# Altium project TM7705.PrjPcb
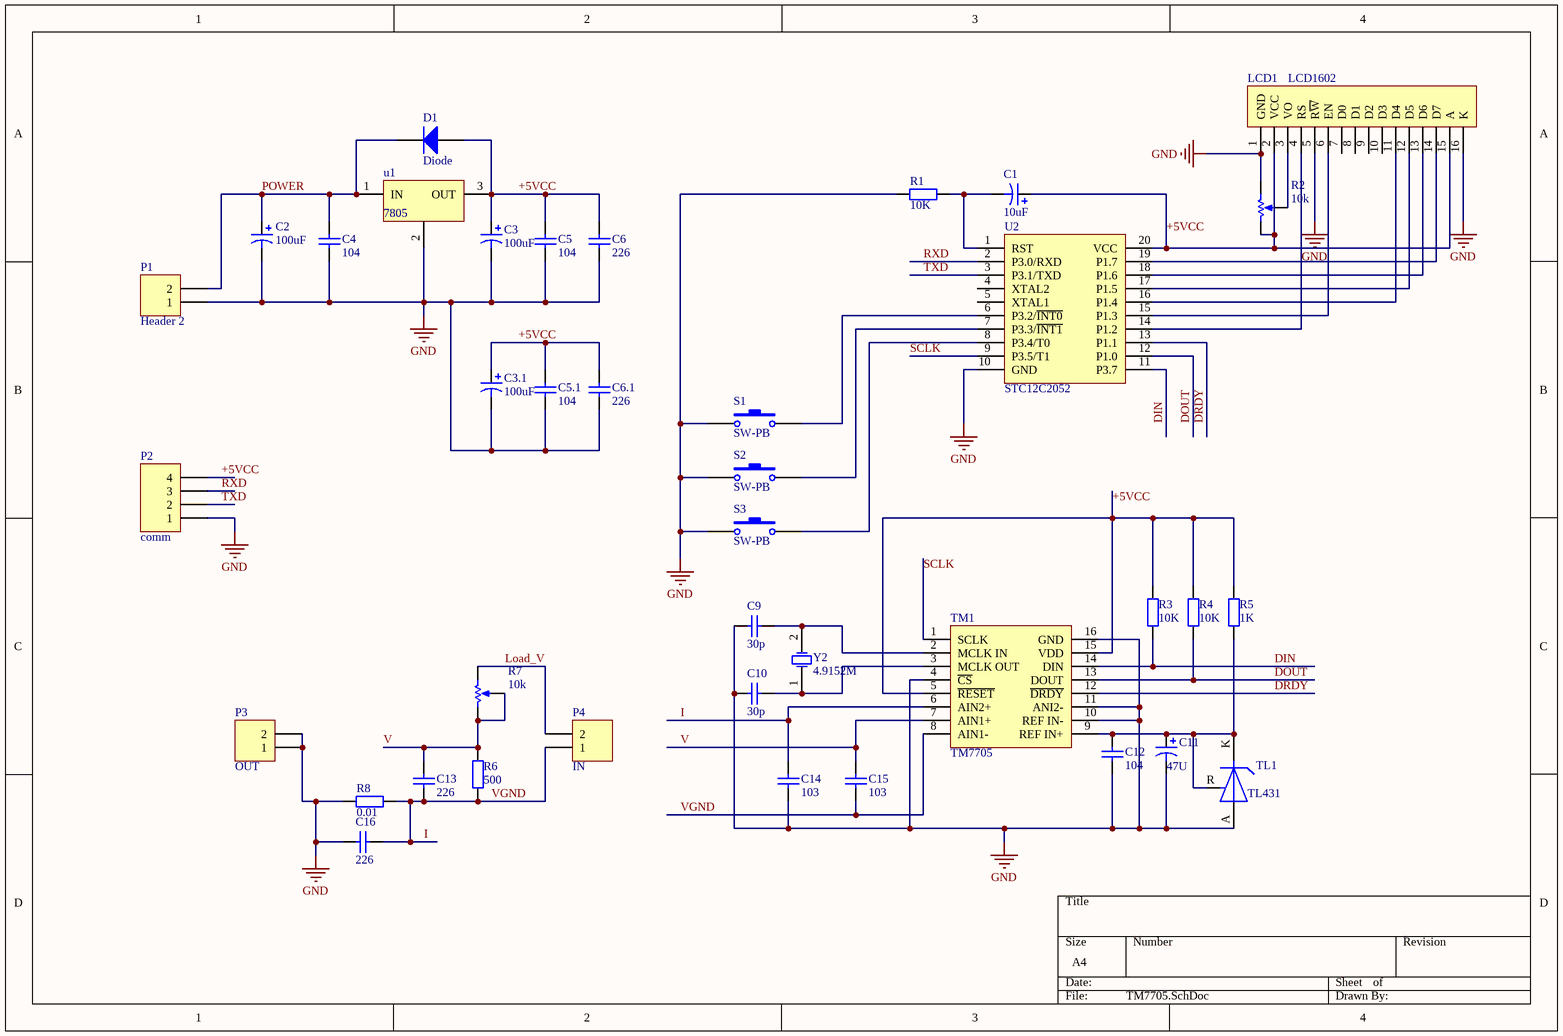
[diagram p0: TM7705.SchDoc]
1 sheet, 39 parts. Net scope: global (net labels, ports and power ports of the same name join across sheets).
Board files: TM7705dayin.PcbDoc, TM7705.PcbDoc

## Sheet TM7705.SchDoc
size A4

### Parts
C1  10uF  [0805]
C2  100uF  [DR3]
C3  100uF  [DR]
C3.1  100uF  [DR]
C4  104  [0805C]
C5  104  [0805C]
C5.1  104  [0805C]
C6  226  [0805C]
C6.1  226  [0805C]
C9  30p  [0805C]
C10  30p  [0805C]
C11  47U  [DR]
C12  104  [0805C]
C13  226  [0805C]
C14  103  [0805C]
C15  103  [0805C]
C16  226  [0805C]
D1  Diode  [DO-214AC]
LCD1  LCD1602  [LCD1602]
P1  Header 2  [HDR1X2]
P2  comm  [HDR1X4]
P3  OUT  [HDR1X2]
P4  IN  [HDR1X2]
R1  10K  [0805R]
R2  10k  [DWQ]
R3  10K  [0805R]
R4  10K  [0805R]
R5  1K  [0805R]
R6  500  [0805R]
R7  10k  [DWQ1]
R8  0.01  [DZ-1W]
S1  SW-PB  [SW]
S2  SW-PB  [SW]
S3  SW-PB  [SW]
TL1  TL431  [TL431]
TM1  TM7705  [SOIC-16]
u1  7805  [DPAK]
U2  STC12C2052  [SOIC-20]
Y2  4.9152M  [JZ]

### Nets
GND: C2.2 C3.2 C3.1.2 C4.1 C5.1 C5.1.1 C6.1 C6.1.1 C9.1 C10.1 C11.2 C12.1 C14.1 C16.2 LCD1.1(GND) LCD1.5(R~{W}) LCD1.16(K) P1.1 P2.1 P3.1 P3.2 R1.2 R2.1(TOP) R8.2 S1.1 S2.1 S3.1 TL1.A TM1.4(~{CS}) TM1.10(REF_IN-) TM1.11(ANI2-) TM1.16(GND) u1.2(GND) U2.10(GND)
+5VCC: C1.1 C3.1 C3.1.1 C5.2 C5.1.2 C6.2 C6.1.2 D1.1(A) LCD1.2(VCC) LCD1.15(A) P2.4 R2.2(BOT) R3.2 R4.2 R5.2 TM1.5(~{RESET}) TM1.15(VDD) u1.3(OUT) U2.20(VCC)
DIN: R3.1 TM1.14(DIN) U2.11(P3.7)
DOUT: R4.1 TM1.13(DOUT) U2.12(P1.0)
DRDY: TM1.12(~{DRDY}) U2.13(P1.1)
I: C13.1 C14.2 C15.1 C16.1 P4.1 R6.1 R8.1 TM1.6(AIN2+) TM1.8(AIN1-)  [also labelled VGND]
Load_V: P4.2 R7.1(TOP)
POWER: C2.1 C4.2 D1.2(K) P1.2 u1.1(IN)
RXD: P2.3 U2.2(P3.0/RXD)
SCLK: TM1.1(SCLK) U2.9(P3.5/T1)
TXD: P2.2 U2.3(P3.1/TXD)
V: C13.2 C15.2 R6.2 R7.2(BOT) R7.3(TAP) TM1.7(AIN1+)
NetC1_2: C1.2 R1.1 U2.1(RST)
NetC9_2: C9.2 TM1.2(MCLK_IN) Y2.2(OSC2)
NetC10_2: C10.2 TM1.3(MCLK_OUT) Y2.1(OSC1)
NetC11_1: C11.1 C12.2 R5.1 TL1.K TL1.R TM1.9(REF_IN+)
NetLCD1_3: LCD1.3(VO) R2.3(TAP)
NetLCD1_4: LCD1.4(RS) U2.14(P1.2)
NetLCD1_6: LCD1.6(EN) U2.15(P1.3)
NetLCD1_11: LCD1.11(D4) U2.16(P1.4)
NetLCD1_12: LCD1.12(D5) U2.17(P1.5)
NetLCD1_13: LCD1.13(D6) U2.18(P1.6)
NetLCD1_14: LCD1.14(D7) U2.19(P1.7)
NetS1_2: S1.2 U2.6(P3.2/~{INT0})
NetS2_2: S2.2 U2.7(P3.3/~{INT1})
NetS3_2: S3.2 U2.8(P3.4/T0)

Not connected (* = marked no-connect by the designer): LCD1 7(D0) 8(D1) 9(D2) 10(D3); U2 4(XTAL2) 5(XTAL1)

### Library data of the parts
C1-C3 C3.1 C11 = Cap Pol1: Polarized Capacitor (Radial); Value: 100pF; Published: 8-Jun-2000; LatestRevisionDate: 17-Jul-2002; LatestRevisionNote: Re-released for DXP Platform.; PackageReference: RB7.6-15; Publisher: Altium Limited; PackageDescription: Polarized Capacitor (Radial); 2 Leads
C4 C5 C5.1 C6 C6.1 C9 C10 C12-C16 = Cap: Capacitor; Value: 100pF; Published: 8-Jun-2000; LatestRevisionDate: 17-Jul-2002; LatestRevisionNote: Re-released for DXP Platform.; PackageReference: RAD-0.3; Publisher: Altium Limited; PackageDescription: Radial Cap, Thru-Hole; 2 Leads; 0.3 in Pin Spacing
D1 = Diode: Default Diode; Published: 8-Jun-2000; LatestRevisionDate: 17-Jul-2002; LatestRevisionNote: Re-released for DXP Platform.; PackageVersion: Sep-1996; PackageReference: SMC; Publisher: Altium Limited; PackageDescription: DO-214-AB/SMC; 2 C-Bend Leads; Body 7.9 x 5.9 mm, inc. leads (LxW); Code_JEDEC: DO-214-AB
P1 P3 P4 = Header 2: Header, 2-Pin; LatestRevisionDate: 17-Jul-2002; LatestRevisionNote: Re-released for DXP Platform.; Publisher: Altium Limited
P2 = Header 4: Header, 4-Pin; LatestRevisionDate: 17-Jul-2002; LatestRevisionNote: Re-released for DXP Platform.; Publisher: Altium Limited
R1 R3 R4 R6 R8 = Res2: Resistor; Value: 1K; Published: 8-Jun-2000; LatestRevisionDate: 17-Jul-2002; LatestRevisionNote: Re-released for DXP Platform.; PackageReference: AXIAL-0.4; Publisher: Altium Limited; PackageDescription: Axial Device, Thru-Hole; 2 Leads; 0.4 in Pin Spacing
R2 R7 = RPot: Potentiometer; Sim Note: Enter the Resistance value and the set point into parameter fields.; Set Position: 0.5; Value: 1K; Published: 8-Jun-2000; LatestRevisionDate: 17-Jul-2002; LatestRevisionNote: Re-released for DXP Platform.; PackageReference: VR5; Publisher: Altium Limited; PackageDescription: Variable Resistor, Thru-Hole; 3 Leads
R5 = Res2: Resistor; Published: 8-Jun-2000; LatestRevisionDate: 17-Jul-2002; LatestRevisionNote: Re-released for DXP Platform.; PackageReference: AXIAL-0.4; Publisher: Altium Limited; PackageDescription: Axial Device, Thru-Hole; 2 Leads; 0.4 in Pin Spacing; Value: 1K
S1-S3 = SW-PB: Switch; Published: 24-Mar-1999; LatestRevisionDate: 17-Jul-2002; LatestRevisionNote: Re-released for DXP Platform.; PackageReference: SPST-2; Publisher: Altium Limited; PackageDescription: Switch; 2 Leads
Y2 = XTAL: Crystal Oscillator; Published: 8-Jun-2000; LatestRevisionDate: 17-Jul-2002; LatestRevisionNote: Re-released for DXP Platform.; PackageReference: R38; Publisher: Altium Limited; PackageDescription: Crystal, Thru-Hole; 2 Leads; Body 3.1 x 8.2 mm (Dia.xH)